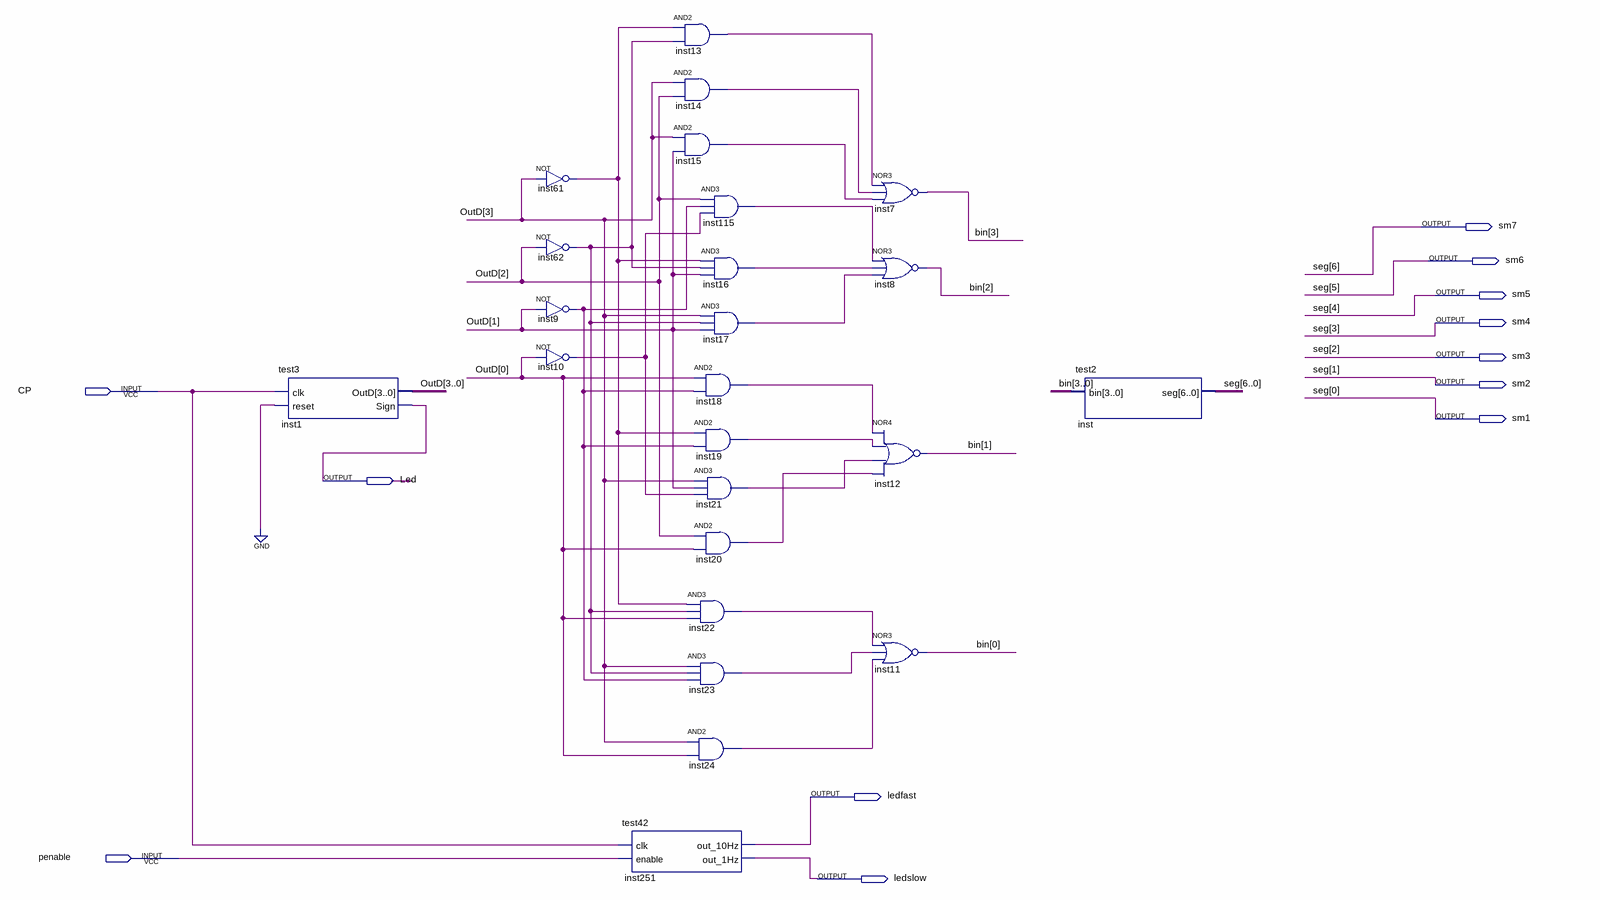
[diagram p0: schematic sheet]
// Quartus schematic test5.bdf as structural Verilog: 24 symbols, 12 pins
module test5 (
  input  CP,
  input  penable,
  output sm7,
  output sm6,
  output sm5,
  output sm4,
  output sm3,
  output sm2,
  output sm1,
  output Led,
  output ledfast,
  output ledslow
);

  wire inst9_out, inst10_out, inst13_out, inst14_out, inst15_out, inst16_out, inst17_out, inst18_out,
       inst19_out, inst20_out, inst21_out, inst22_out, inst23_out, inst24_out, inst61_out, inst62_out,
       inst115_out;
  wire [3:0] bin, OutD;

  test3 inst1 (.clk(CP), .reset(1'b0), .OutD(OutD), .Sign(Led));
  not inst61 (inst61_out, OutD[3]);
  not inst62 (inst62_out, OutD[2]);
  not inst9 (inst9_out, OutD[1]);
  not inst10 (inst10_out, OutD[0]);
  test42 inst251 (.clk(CP), .enable(penable), .out_10Hz(ledfast), .out_1Hz(ledslow));
  and inst13 (inst13_out, inst61_out, inst62_out);
  and inst14 (inst14_out, OutD[3], OutD[2]);
  and inst15 (inst15_out, OutD[3], OutD[1]);
  and inst115 (inst115_out, OutD[2], inst9_out, inst10_out);
  and inst16 (inst16_out, inst61_out, inst62_out, OutD[1]);
  and inst17 (inst17_out, OutD[3], inst62_out, OutD[1]);
  and inst18 (inst18_out, OutD[0], inst9_out);
  and inst19 (inst19_out, inst61_out, inst9_out);
  and inst21 (inst21_out, OutD[3], OutD[1], inst10_out);
  and inst20 (inst20_out, OutD[2], OutD[0]);
  and inst22 (inst22_out, inst61_out, inst62_out, OutD[0]);
  and inst23 (inst23_out, OutD[3], inst62_out, inst9_out);
  and inst24 (inst24_out, OutD[3], OutD[0]);
  nor inst7 (bin[3], inst13_out, inst14_out, inst15_out);
  nor inst8 (bin[2], inst115_out, inst16_out, inst17_out);
  nor inst12 (bin[1], inst18_out, inst19_out, inst21_out, inst20_out);
  nor inst11 (bin[0], inst22_out, inst23_out, inst24_out);
  test2 inst (.bin(bin), .seg({sm7, sm6, sm5, sm4, sm3, sm2, sm1}));

  // Other names for the same wires on the sheet: seg[6:0] = {sm7, sm6, sm5, sm4, sm3, sm2, sm1}
endmodule
